# Altium schematic sheet GyroAccelHeaders.SchDoc
size A
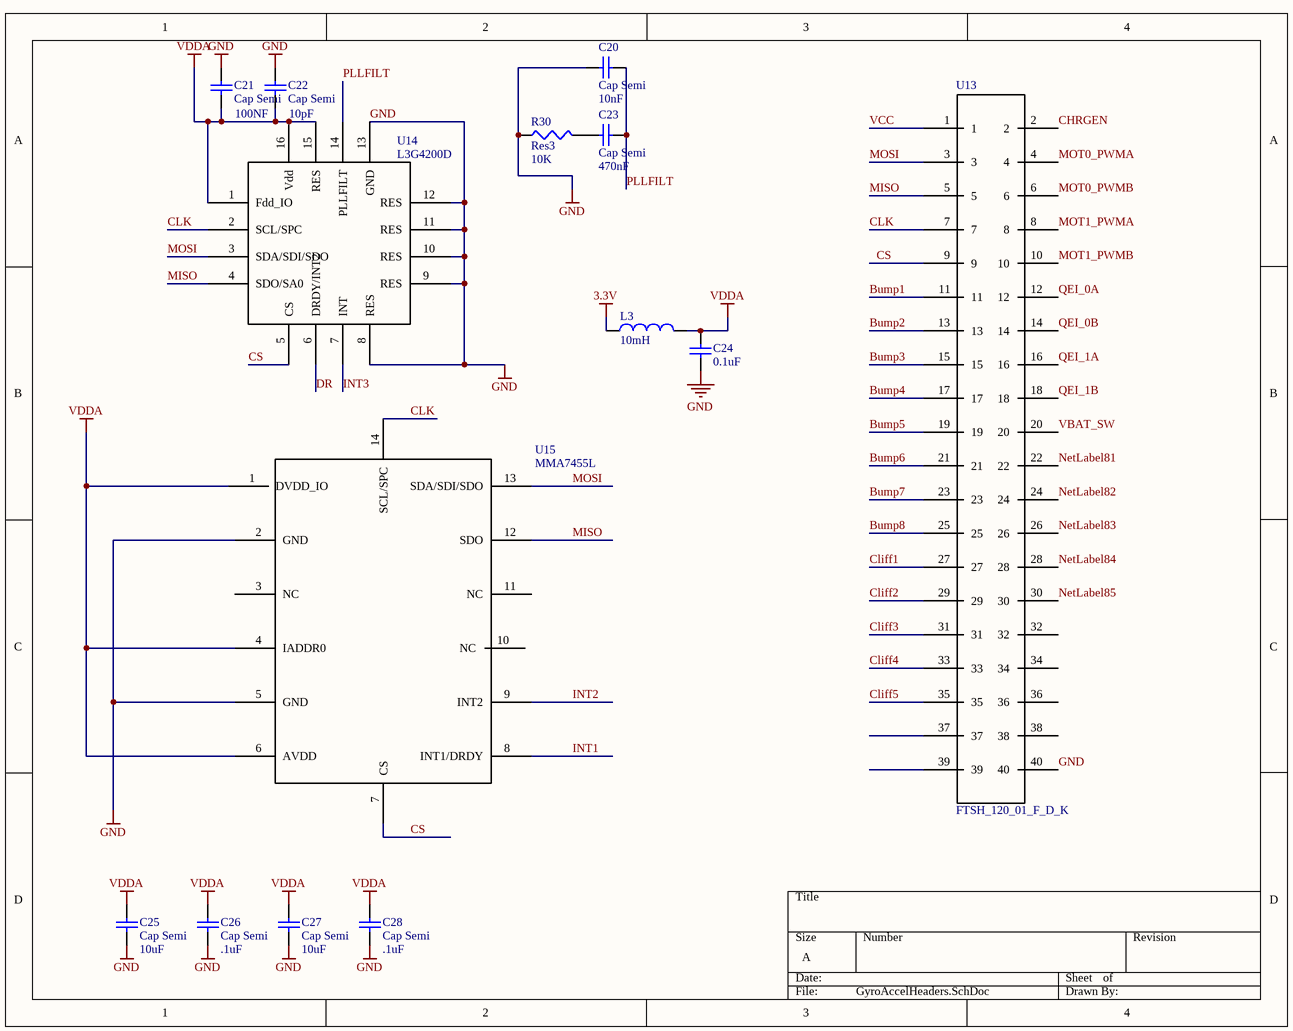
[diagram p0: GyroAccelHeaders.SchDoc]

## Parts
C20  Cap Semi  value 10nF  [CAPC3216L]
C21  Cap Semi  value 100NF  [CAPC3216L]
C22  Cap Semi  value 10pF  [CAPC3216L]
C23  Cap Semi  value 470nF  [CAPC3216L]
C24  value 0.1uF  [CAPC1005L]  (hidden comment: Cap Semi)
C25  Cap Semi  value 10uF  [CAPC3216L]
C26  Cap Semi  value .1uF  [CAPC3216L]
C27  Cap Semi  value 10uF  [CAPC3216L]
C28  Cap Semi  value .1uF  [CAPC3216L]
L3  value 10mH  [INDC2012L]  (hidden comment: Inductor)
R30  Res3  value 10K  [RESC1608L]
U13  FTSH_120_01_F_D_K  [FTSH_120_01_F_D_K]
U14  L3G4200D  [L3G4200D]
U15  MMA7455L  [MMA7455L]

## Nets
3.3V: L3.2
GND: C20.1 C21.2 C22.2 C24.1 C25.1 C26.1 C27.1 C28.1 R30.1 U13.40 U14.8(RES) U14.9(RES) U14.10(RES) U14.11(RES) U14.12(RES) U14.13(GND) U15.2(GND) U15.5(GND)
VDDA: C21.1 C22.1 C24.2 C25.2 C26.2 C27.2 C28.2 L3.1 U14.1(Fdd_IO) U14.15(RES) U14.16(Vdd) U15.1(DVDD_IO) U15.4(IADDR0) U15.6(AVDD)
Bump1: U13.11
Bump2: U13.13
Bump3: U13.15
Bump4: U13.17
Bump5: U13.19
Bump6: U13.21
Bump7: U13.23
Bump8: U13.25
CHRGEN: U13.2
Cliff1: U13.27
Cliff2: U13.29
Cliff3: U13.31
Cliff4: U13.33
Cliff5: U13.35
CLK: U13.7 U14.2(SCL/SPC) U15.14(SCL/SPC)
CS: U13.9 U14.5(CS) U15.7(CS)
DR: U14.6(DRDY/INT2)
INT1: U15.8(INT1/DRDY)
INT2: U15.9(INT2)
INT3: U14.7(INT)
MISO: U13.5 U14.4(SDO/SA0) U15.12(SDO)
MOSI: U13.3 U14.3(SDA/SDI/SDO) U15.13(SDA/SDI/SDO)
MOT0_PWMA: U13.4
MOT0_PWMB: U13.6
MOT1_PWMA: U13.8
MOT1_PWMB: U13.10
NetLabel81: U13.22
NetLabel82: U13.24
NetLabel83: U13.26
NetLabel84: U13.28
NetLabel85: U13.30
PLLFILT: C20.2 C23.2 U14.14(PLLFILT)
QEI_0A: U13.12
QEI_0B: U13.14
QEI_1A: U13.16
QEI_1B: U13.18
VBAT_SW: U13.20
VCC: U13.1
NetC23_1: C23.1 R30.2

Not connected (* = marked no-connect by the designer): U13 32 34 36 37 38 39; U15 3(NC) 10(NC) 11(NC)

## Library data of the parts
C20-C28 = Cap Semi: Capacitor (Semiconductor SIM Model); Published: 8-Jun-2000; LatestRevisionDate: 29-May-2009; LatestRevisionNote: IPC-7351 Footprint Added.; PackageReference: C1206; Publisher: Altium Limited; PackageDescription: Chip Capacitor
L3 = Inductor: Code_IEC: 1005; Published: 8-Jun-2000; LatestRevisionDate: 29-May-2009; LatestRevisionNote: IPC-7351 Footprint Added.; PackageReference: 0402-A; Publisher: Altium Limited; PackageDescription: Chip Inductor; Code_JEITA: 0402
R30 = Res3: Resistor; Published: 8-Jun-2000; LatestRevisionDate: 29-May-2009; LatestRevisionNote: IPC-7351 Footprint Added.; PackageReference: J1-0603; Publisher: Altium Limited; PackageDescription: Chip Resistor
U13 = FTSH_120_01_F_D_K: Header, 2X20, 50mil, IDC
U14 = L3G4200D: 3axis gyroscope, SPI
U15 = MMA7455L: 3axis accelerometer